# EAGLE design 477ProjectBattery (EAGLE 6.4)
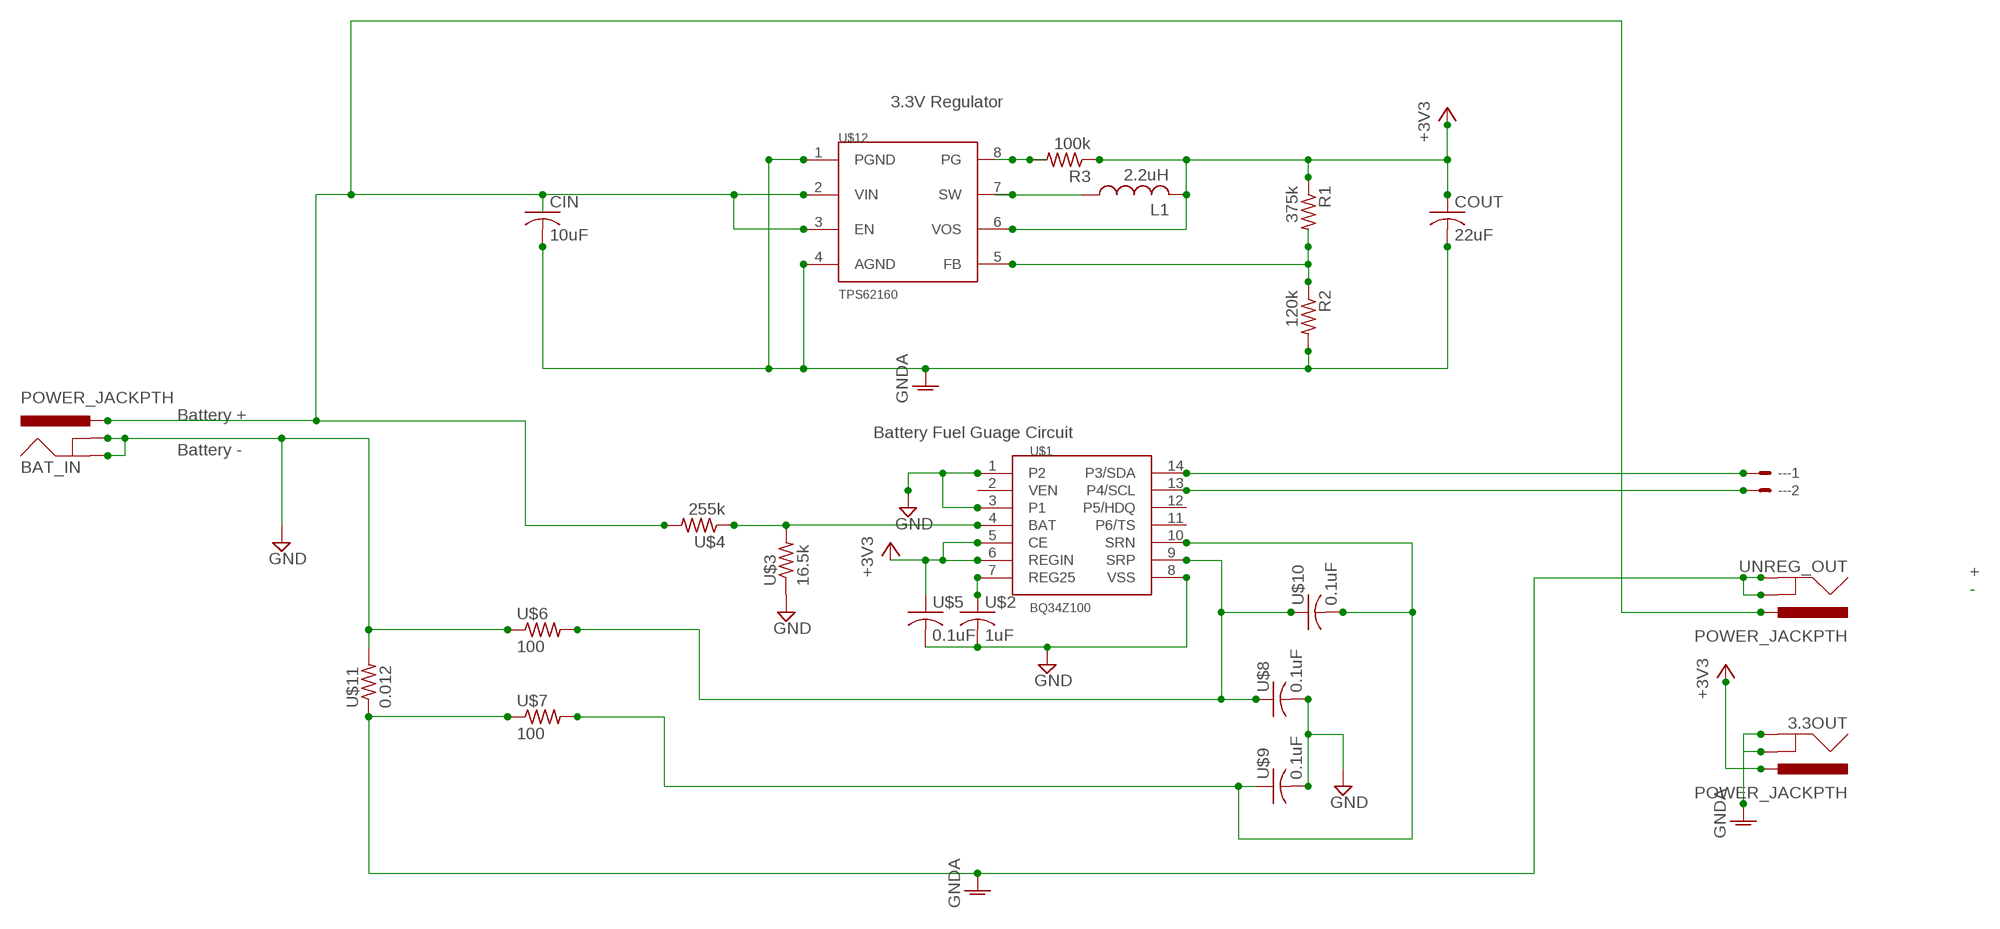
[diagram p0: schematic, sheet 1]

## Parts
3.3OUT  POWER_JACKPTH  [POWER_JACK_PTH]
--  22-23-2021  [22-23-2021]
BAT_IN  POWER_JACKPTH  [POWER_JACK_PTH]
CIN  10uF  C-US-1206  [C1206]
COUT  22uF  C-US-1206  [C1206]
L1  2.2uH  SDR0403  [SDR0403]
R1  375k  R-US"  [R1206]
R2  120k  R-US"  [R1206]
R3  100k  R-US"  [R1206]
U$1  BQ34Z100  [SSOP-14]
U$2  1uF  C-US-1206  [C1206]
U$3  16.5k  R-US"  [R1206]
U$4  255k  R-US"  [R1206]
U$5  0.1uF  C-US-1206  [C1206]
U$6  100  R-US"  [R1206]
U$7  100  R-US"  [R1206]
U$8  0.1uF  C-US-1206  [C1206]
U$9  0.1uF  C-US-1206  [C1206]
U$10  0.1uF  C-US-1206  [C1206]
U$11  0.012  R-USCS  [WSL2816]
U$12  TPS62160  [MSOP-8]
UNREG_OUT  POWER_JACKPTH  [POWER_JACK_PTH]

## Nets
+3V3: 3.3OUT.PWR COUT.1 L1.B R1.1 R3.1 U$1.5(CE) U$1.6(REGIN) U$5.1 U$12.6(VOS)
GND: BAT_IN.GND BAT_IN.GNDBREAK U$1.1(P2) U$1.3(P1) U$1.8(VSS) U$2.2 U$3.1 U$5.2 U$6.1 U$8.2 U$9.2 U$11.2
GNDA: 3.3OUT.GND 3.3OUT.GNDBREAK CIN.2 COUT.2 R2.2 U$7.1 U$11.1 U$12.1(PGND) U$12.4(AGND) UNREG_OUT.GND UNREG_OUT.GNDBREAK
N$1: U$1.9(SRP) U$6.2 U$8.1 U$10.1
N$2: U$1.4(BAT) U$3.2 U$4.1
N$3: U$1.10(SRN) U$7.2 U$9.1 U$10.2
N$4: BAT_IN.PWR CIN.1 U$4.2 U$12.2(VIN) U$12.3(EN) UNREG_OUT.PWR
N$5: --.2 U$1.13(P4/SCL)
N$6: --.1 U$1.14(P3/SDA)
N$7: U$1.7(REG25) U$2.1
N$36: L1.A U$12.7(SW)
N$37: R3.2 U$12.8(PG)
N$40: R1.2 R2.1 U$12.5(FB)
Unconnected: U$1.2(VEN) U$1.11(P6/TS) U$1.12(P5/HDQ)

## Notes on the sheet
- 3.3V Regulator
- Battery +
- Battery Fuel Guage Circuit
- Battery -
- +
- - | -

## Library data of the parts
3.3OUT BAT_IN UNREG_OUT = SparkFun-Connectors:POWER_JACK: Power Jack This is the standard 5.5mm barrel jack for power. The PTH is the most common, proven, reliable, footprint. The Slot footprint only works if the mill layer is transmitted to the PCB fab house so be warned. Spark Fun Electronics SKU : PRT-00119 SMT: CONN-08106 Mating wall wart : TOL-00298 (and others)
-- = con-molex:22-23-2021: .100" (2.54mm) Center Header - 2 Pin; MF: MOLEX; MPN: 22-23-2021; OC_FARNELL: 1462926; OC_NEWARK: 25C3832
CIN COUT U$2 U$5 U$8-U$10 = MinotaurParts:C-US-1206
L1 = MinotaurParts:SDR0403
R1-R3 U$3 U$4 U$6 U$7 U$11 = MinotaurParts:R-US: Surface mount resistor
U$1 = MinotaurParts:BQ34Z100: Battery fuel guage IC for lithium lion batteries
U$12 = MinotaurParts:TPS62160: adjustable switching regulator for the 3.3 volt and 5 volt rails

## Board
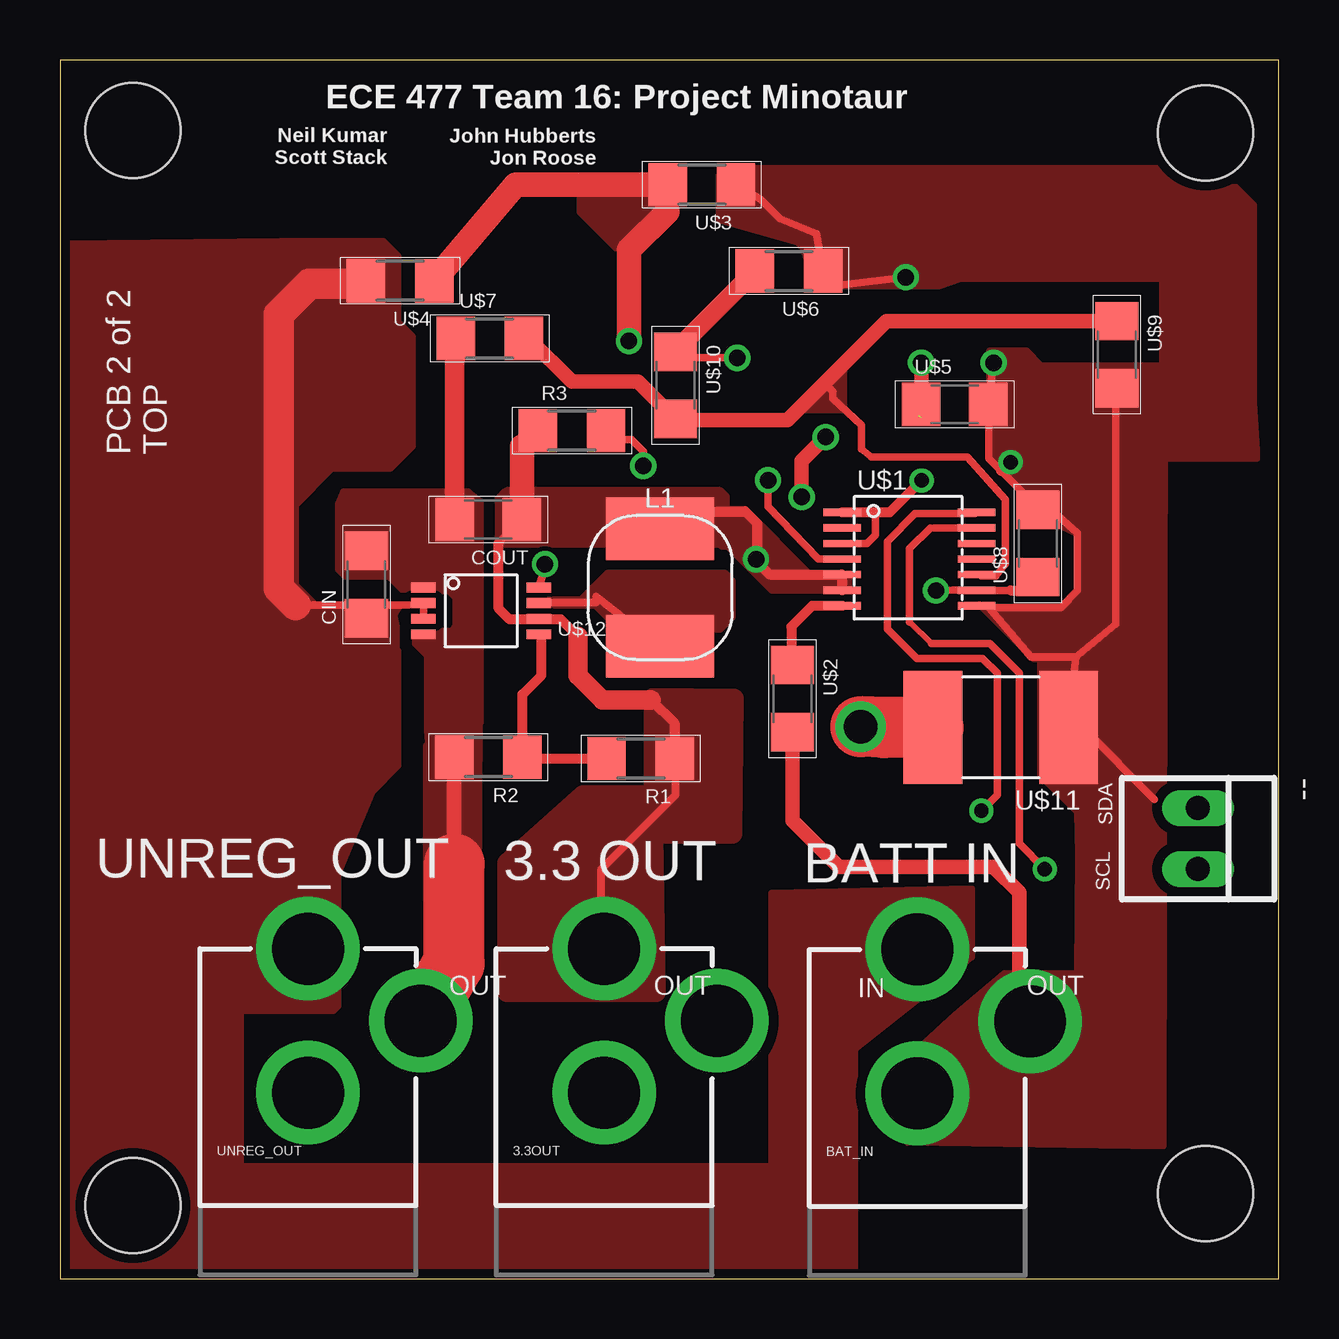
[diagram p1: board, top side]
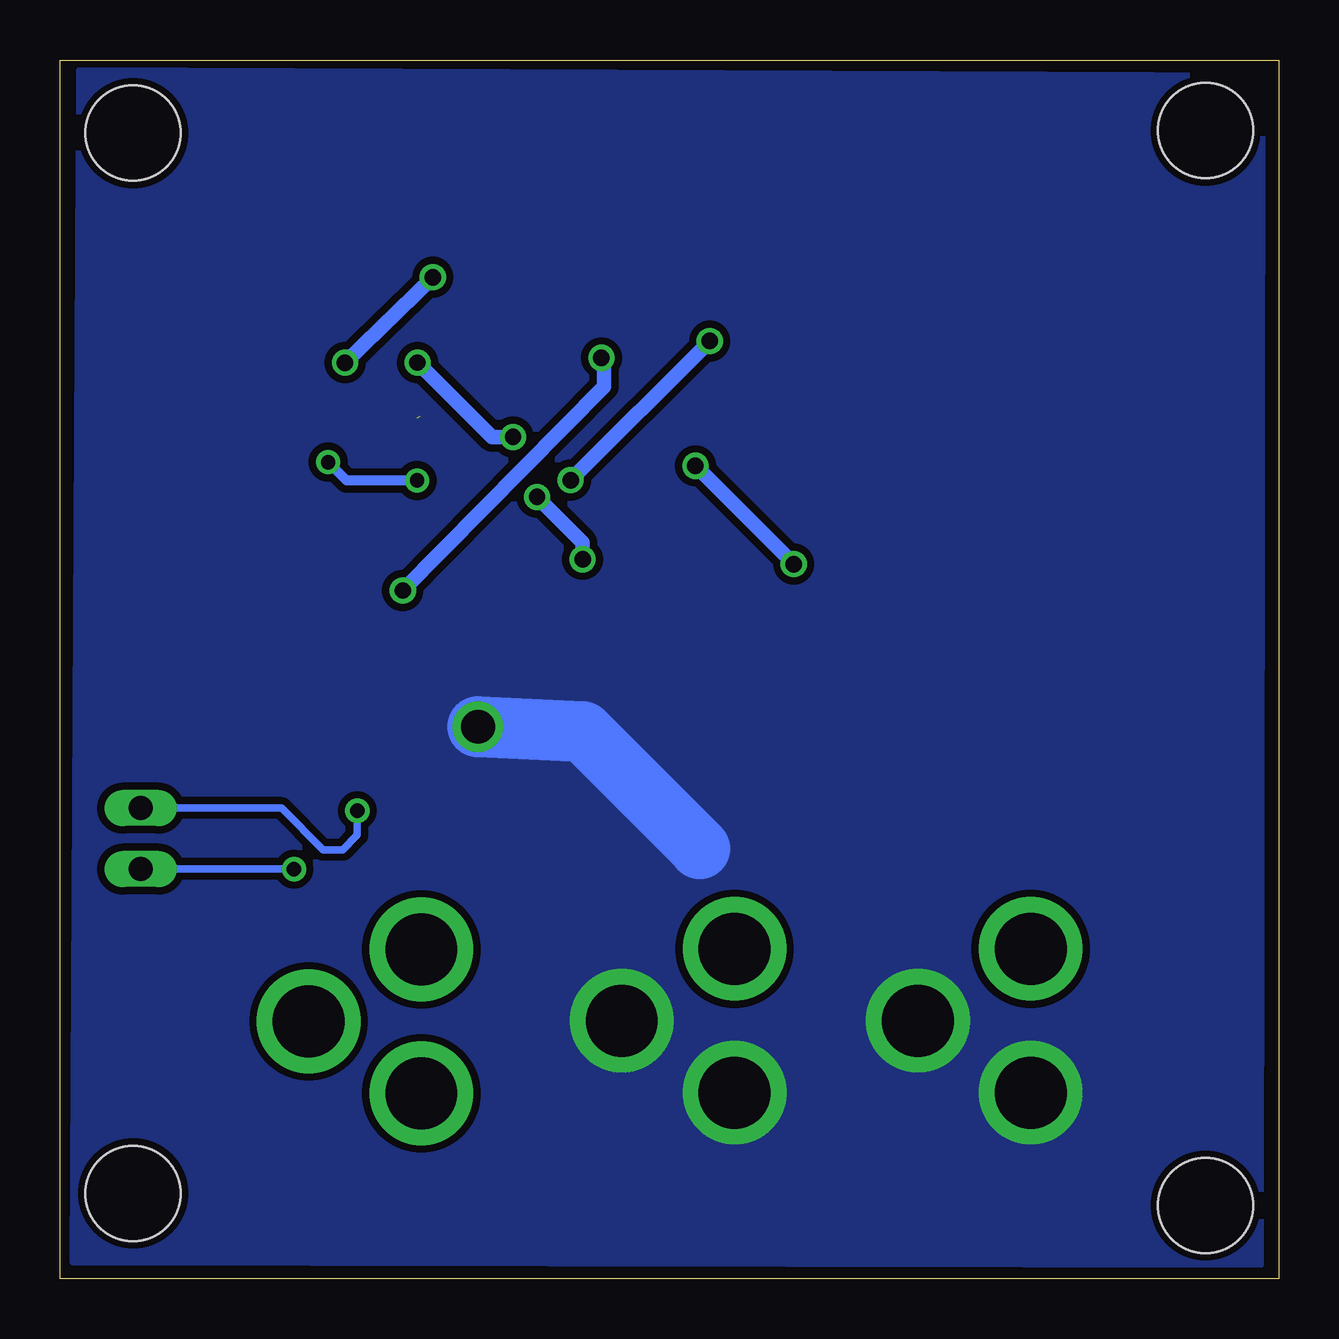
[diagram p2: board, bottom side, seen from below]

Size 50.8 x 50.8 mm. Coordinates in mm from the lower left corner, seen from the top.
Outline: 0,0 50.8,0 50.8,50.8 0,50.8 0,0
Copper layers (1*16): Top 0.035mm / dielectric 1.5mm / Bottom 0.035mm
Design rules "default *": minimum track width 8mil, minimum drill 19mil, track to track 7mil, track to pad 7mil, pad to pad 7mil, via to via 10mil, smd to smd 7mil, copper to edge 10mil, drill to drill 8mil, minimum pad ring 10mil, minimum via ring 8mil, stop-mask expansion 4mil, vias tented up to drill 0mil, thermal gap 10mil
Holes 3.96 mm at 3.05,47.85 47.75,47.75 47.75,3.56 3.05,3.05

### Footprints (pad centres in the part's own frame; a part is rotated, then mirrored left to right if it is on the bottom)
POWER_JACK_PTH = drill 2.997 pad 4.318: GND 0,7.7; GNDBREAK 4.7,10.7; PWR 0,13.7
22-23-2021 = drill 1 long: 1 -1.27,0; 2 1.27,0
C1206 = smd 1.6 x 1.8: 1 -1.4,0; 2 1.4,0
SDR0403 = smd 4.5 x 2.6: A 0,2.45; B 0,-2.45
R1206 = smd 1.6 x 1.803: 1 -1.422,0; 2 1.422,0
SSOP-14 = smd 0.3 x 1.55: 1 -1.95,-2.8; 2 -1.3,-2.8; 3 -0.65,-2.8; 4 0,-2.8; 5 0.65,-2.8; 6 1.3,-2.8; 7 1.95,-2.8; 8 1.95,2.8; 9 1.3,2.8; 10 0.65,2.8; 11 0,2.8; 12 -0.65,2.8; 13 -1.3,2.8; 14 -1.95,2.8
WSL2816 = smd 4.7 x 2.45: 1 0,2.825; 2 0,-2.825
MSOP-8 = smd 0.41 x 1.02: 1 -0.975,-2.4; 2 -0.325,-2.4; 3 0.325,-2.4; 4 0.975,-2.4; 5 0.975,2.4; 6 0.325,2.4; 7 -0.325,2.4; 8 -0.975,2.4

### Placement (x,y rotation side)
3.3OUT  22.68,0.05 0 top
--  47.44,18.34 270 top
BAT_IN  35.74,0.03 0 top
CIN  12.77,28.94 90 top
COUT  17.85,31.65 180 top
L1  25.02,28.81 180 top
R1  24.2,21.69 180 top
R2  17.85,21.74 180 top
R3  21.34,35.35 0 top
U$1  35.4,30 270 top
U$2  30.53,24.18 270 top
U$3  26.75,45.61 180 top
U$4  14.17,41.6 180 top
U$5  37.29,36.45 0 top
U$6  30.39,42.01 180 top
U$7  17.91,39.2 0 top
U$8  40.76,30.65 90 top
U$9  44.05,38.52 270 top
U$10  25.65,37.24 270 top
U$11  39.22,22.98 90 top
U$12  17.55,27.84 270 top
UNREG_OUT  10.34,0.05 0 top

### Tracks (layer width: path | path; a pad name or v marks a point on that pad's centre or on a via)
+3V3  (via drill 0.69)  (1 unrouted)
  Top 0.305: U$5.1 35.8,35.97 35.81,35.99 | 25.52,31.99 L1.B 25.55,32.03 25.61,32.09 25.32,32.09 | 20.21,27.49 20.24,27.51 U$12.6 19.98,27.48 | 19.11,31.51 COUT.1 18.29,30.68 | 19.25,34.69 R3.1 | 35.91,36.99 35.91,35.89 | 22.68,13.89 3.3OUT.PWR 22.55,13.88 22.55,17.07 25.65,20.17 25.65,22.17 25.63,22.2
  Top 0.406: U$1.6 U$1.5 32.59,29.36 29.57,29.36 29.06,29.87 29.06,30.03 | 20.21,27.49 18.74,27.49 18.29,27.94 18.29,30.68 | R1.1 25.63,22.2 25.63,23.14 24.64,24.13 | 21.59,26.77 20.88,27.48 19.98,27.48 | 25.52,31.99 28.57,31.99 29.06,31.5 29.06,30.03 | 29.06,30.03 v29.02,29.99
  Top 0.61: v30.91,32.59 30.91,34.09 v31.91,35.09 | 35.91,36.99 35.91,37.19 v35.9,38.19
  Top 0.813: 24.64,24.13 22.61,24.13 21.59,25.15 21.59,26.77
  Top 1.016: COUT.1 19.25,34.69
  Bottom 0.61: v29.02,29.99 29.02,30.69 v30.91,32.59 | v31.91,35.09 32.8,35.09 v35.9,38.19
  pour Top (no thermals): 18.51,30.69 27.61,30.69 27.71,30.79 27.71,32.59 27.51,32.79 18.61,32.79 18.31,32.49 18.31,30.89
  pour Top (no thermals): 18.64,11.94 18.64,17.32 21.79,20.17 24.74,20.17 24.74,24.23 28.09,24.18 28.04,18.54 24.74,18.54 24.84,11.94
  pour Top (no thermals): 27.58,30.53 27.84,30.53 29.67,28.7 32.87,28.7 32.87,29.36 31.24,29.36 28.55,32.05 27.64,32.05 27.58,32
GND  (via drill 0.6, 0.69)
  Top 0.254: 38.31,28.09 38.62,28.09 38.72,27.99
  Top 0.305: 42.34,25.92 U$11.2 42.65,22.95 45.62,19.99 | 42.34,25.92 44.02,27.29 44.02,37.08 U$9.2 | 42.34,25.92 40.48,25.92 38.72,27.99 41.72,27.99 42.41,28.69 42.41,31.09 41.41,31.99 40.83,31.99 U$8.2 40.81,32.1 40.8,32.1 39.22,33.68 38.72,34.19 38.72,35.82 U$5.2 38.62,35.92 v38.92,38.18 | U$1.8 38.27,28.05 38.31,28.09 | U$3.1 29.2,45 30.02,44.19 31.54,43.56 U$6.1 31.35,41.4 31.46,41.29 v35.26,41.74 | U$1.3 33.64,30.65 33.98,30.99 33.98,31.89 34.04,31.95
  Top 0.406: 39.98,11.18 BAT_IN.GNDBREAK | U$1.1 34.04,31.95 34.59,31.95 v35.92,33.27 | v39.62,34.04 39.57,34.04 39.22,33.68
  Top 0.61: U$2.2 30.53,19.1 32.46,17.17 38.91,17.17 39.98,16.1 39.98,11.18
  Bottom 0.406: v35.92,33.27 38.86,33.27 v39.62,34.04
  Bottom 0.61: v35.26,41.74 v38.92,38.18
  pour Top (isolate 0.406, no thermals): 46,34.19 45.97,41.71 37.54,41.71 36.63,41.4 31.45,41.4 31.04,42.93 30.73,43.23 27.48,44.15 27.48,45.97 27.79,46.28 48.21,46.28 49.73,44.75 49.73,36.53 49.89,34.21
  pour Top (isolate 0.406, no thermals): 38.76,34.39 38.76,38.66 40.28,38.66 40.89,38.05 45.77,38.05 46.02,37.13 45.97,5.54 35.33,5.71 34.09,7.67 35.81,9.6 37.34,11 39.37,12.7 42.42,12.73 42.47,17.68 42.42,19.46 40.89,20.98 40.89,25.86 40.59,25.86 38.46,27.99 41.81,27.99 42.42,28.6 42.42,31.04 41.2,31.65 40.28,31.65 39.98,33.17
GNDA  (via drill 1.4)
  Top 0.305: 16.43,15.6 16.32,15.49
  Top 0.61: R2.2 16.43,17.27 16.43,15.6
  Top 0.813: COUT.2 16.45,37.94 U$7.1
  Top 2.54: U$11.1 34.35,22.98 v33.38,23.01 | UNREG_OUT.GNDBREAK 16.43,13.16 16.43,17.27
  Bottom 2.54: v33.38,23.01 29.01,22.81 24.13,17.93
  pour Top (isolate 0.305, no thermals): 16.21,28.69 14.31,28.69 13.71,29.29 11.91,29.29 11.61,29.59 11.61,32.29 11.81,32.79 17.01,32.79 17.51,32.39 17.51,23.19 17.11,22.79 15.41,21.87 15.31,22.88 15.31,25.99 14.81,26.49 14.81,26.89 14.91,26.99 16.31,26.99 16.51,27.19 16.51,28.39
  pour Bottom (isolate 0.305, no thermals): 49.99,50.34 50.24,0.71 0.76,0.61 0.71,50.11
  pour Top (no thermals): 15.29,22.2 17.48,23.37 17.42,16.1 17.12,15.49 15.6,15.49 15.29,15.8
N$1  (via drill 0.69)
  Top 0.305: U$8.1 40.17,29.25 | 39.62,28.69 38.91,28.69 38.91,28.7 U$1.9 37.23,28.7 36.62,28.69 v36.51,28.69 | v28.23,38.39 25.91,38.39 U$10.1
  Top 0.406: 39.62,28.69 40.2,28.69 U$8.1
  Top 0.813: U$10.1 25.66,38.7 U$6.2
  Bottom 0.61: v36.51,28.69 28.12,37.18 28.12,38.28 v28.23,38.39
N$2  (via drill 0.69)
  Top 0.305: U$1.4 31.61,30 29.52,32.19 v29.52,33.29 | 25.32,44.49 25.32,44.98 U$3.2
  Top 1.016: U$3.2 19,45.61 U$4.1 | v23.71,39.09 23.71,42.89 25.32,44.49
  Bottom 0.61: v29.52,33.29 v23.71,39.09
  pour Top (no thermals): 21.69,45.97 21.69,44.45 23.22,42.93 25.35,44.15 25.35,45.06 25.04,45.97
N$3
  Top 0.305: 25.7,35.79 U$10.2 25.41,36.09 | U$1.10 38.45,29.35 38.82,29.29 | 38.82,29.29 38.41,29.29 | 38.82,29.29 39.02,29.29 39.41,29.79 39.41,32.49 37.81,34.24 33.81,34.24 33.41,34.59 33.41,35.59 32.22,36.69 32.22,36.99 31.86,37.34
  Top 0.61: U$9.1 34.45,39.92 31.86,37.34 30.32,35.79 25.7,35.79 | 25.41,36.09 24.1,37.39 21.34,37.39 19.53,39.2 U$7.2
  pour Top: 30.84,36.22 32.66,36.22 32.66,38.05
N$4
  Top 0.305: CIN.1 12.78,27.53 12.81,27.49 13.41,27.49 13.41,28.09 | 15.41,27.49 15.44,27.51 U$12.3 U$12.2 14.54,28.09 13.41,28.09 | 13.41,28.09 9.81,28.09 | 12.64,41.49 U$4.2
  Top 1.27: 9.81,28.09 9.12,28.79 9.12,40.19 10.41,41.49 12.64,41.49
  pour Top (no thermals): 13.59,27.98 10.91,27.98 10.61,27.99 10.61,25.99 10.91,25.69 13.61,25.69 14.01,26.09 14.01,27.18 13.91,27.68 14.1,27.99 14.2,28.09
  pour Top (isolate 0.406, no thermals): 14.07,26.16 12.55,25.86 11.02,27.38 11.02,27.69 9.8,28.91 9.8,32.26 11.33,33.78 13.77,33.78 14.68,34.7 14.68,39.27 14.07,39.88 14.07,42.62 13.46,43.23 9.19,43.23 0.15,43.13 0.15,15.6 0.2,0 33.12,0.2 33.12,9.55 38,13.41 38,16.26 29.67,16.05 29.67,4.67 7.52,4.67 7.52,11.18 11.38,11.18 11.58,11.38 11.58,16.87 13,20.32 14.07,21.39
N$5  (via drill 0.6)
  Top 0.254: 36.42,31.3 36.27,31.3 | 35.41,27.38 36.32,26.47
  Top 0.305: U$1.13 36.42,31.3 | 36.27,31.3 35.41,30.43 35.41,27.38 | 36.32,26.47 38.76,26.47 39.98,25.25 39.98,18.14 v41.05,17.07
  Bottom 0.305: v41.05,17.07 --.2
N$6  (via drill 0.6)
  Top 0.305: U$1.14 38.15,31.89 35.65,31.89 34.49,30.73 34.49,27.08 35.71,25.86 38.46,25.86 39.06,25.25 39.06,20.17 v38.41,19.51
  Bottom 0.305: v38.41,19.51 38.41,18.49 39.01,17.88 39.83,17.88 41.56,19.61 --.1
N$7
  Top 0.406: U$1.7 31.35,28.05 30.48,27.18 30.48,25.63 U$2.1
N$36
  Top 0.305: L1.A 22.35,28.43 22.35,28.19 19.95,28.19 U$12.7
  pour Top (no thermals): 20.41,28.29 21.71,28.29 22.81,29.39 27.71,29.39 28.01,29.09 28.01,27.59 27.51,27.09 23.31,27.09 22.31,28.09 20.61,28.09
N$37  (via drill 0.69)
  Top 0.305: U$12.8 20.25,29.75 v20.21,29.79 | v24.32,33.89 24.32,34.49 23.82,34.99 22.52,34.99 R3.2
  Bottom 0.61: v20.21,29.79 v24.32,33.89
N$40
  Top 0.406: R1.2 19.33,21.69 R2.1 19.28,24.36 20.07,25.15 20.07,26.75 U$12.5

### Text on the board
tPlace: ECE 477 Team 16: Project Minotaur | Neil Kumar / Scott Stack | John Hubberts / Jon Roose | PCB 2 of 2 / TOP | SDA | UNREG_OUT | 3.3 OUT | BATT IN | SCL | OUT | OUT | IN | OUT